# Altium project Breakout_14pin.PrjPcb
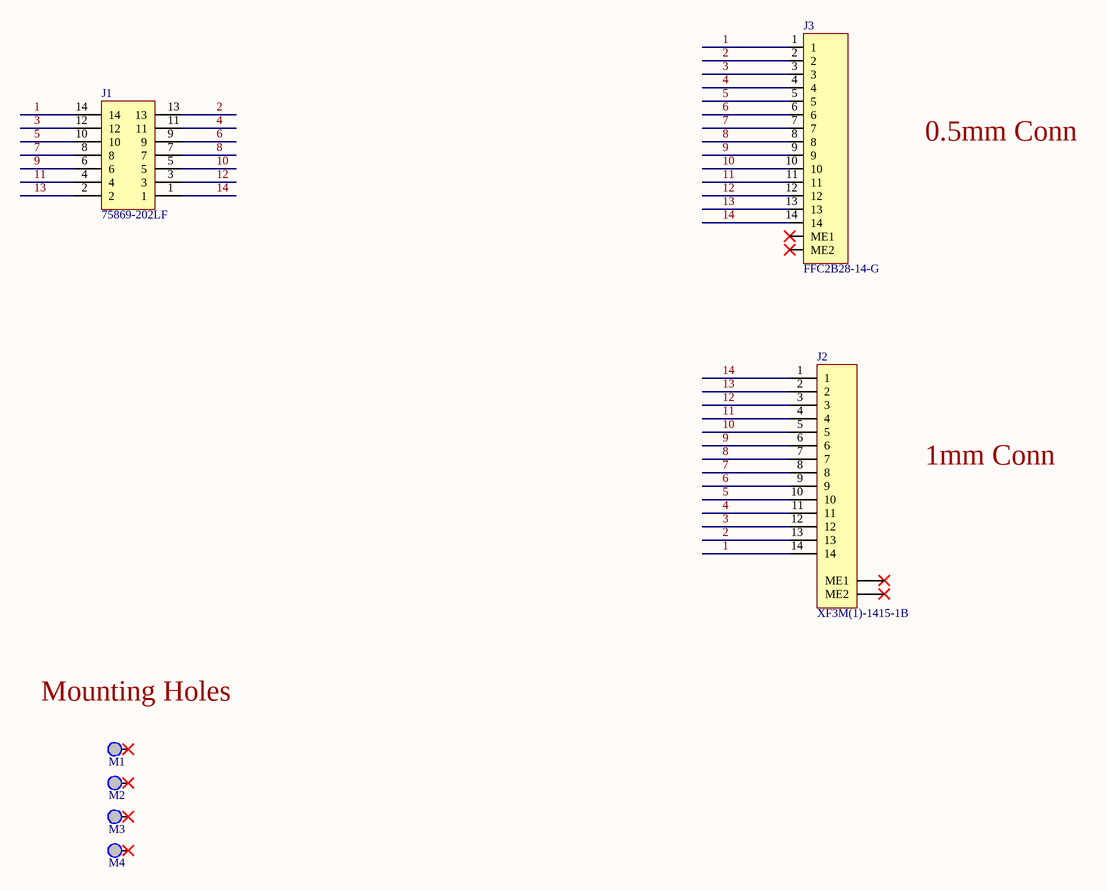
[diagram p0: Main.SchDoc]
ProjectName: Breakout_14pin; Rev: A
1 sheet, 7 parts. Net scope: global (net labels, ports and power ports of the same name join across sheets).
Board file: Breakout_14pin.PcbDoc

## Sheet Main.SchDoc: Breakout 14pin
size A3; Organization: INTERCREATE; Address1: 2415 3RD ST. SUITE #232; Address2: SAN FRANCISCO CA 94107; Revision: A; SheetNumber: 1; SheetTotal: 1; ProjectName: KAGWERKS COMMAND CENTER

### Parts
J1  75869-202LF  [HDR-V-2x7-KEYED]
J2  XF3M(1)-1415-1B  [CONN-FFC-H-14P-1MM]
J3  FFC2B28-14-G  [CONN-FFC-H-14P-0.5MM]
M1  MTG_HOLE  [MH_P_2.5MM]  (value not drawn)  (no BOM)
M2  MTG_HOLE  [MH_P_2.5MM]  (value not drawn)  (no BOM)
M3  MTG_HOLE  [MH_P_2.5MM]  (value not drawn)  (no BOM)
M4  MTG_HOLE  [MH_P_2.5MM]  (value not drawn)  (no BOM)

### Nets
1: J1.14 J2.14 J3.1
2: J1.13 J2.13 J3.2
3: J1.12 J2.12 J3.3
4: J1.11 J2.11 J3.4
5: J1.10 J2.10 J3.5
6: J1.9 J2.9 J3.6
7: J1.8 J2.8 J3.7
8: J1.7 J2.7 J3.8
9: J1.6 J2.6 J3.9
10: J1.5 J2.5 J3.10
11: J1.4 J2.4 J3.11
12: J1.3 J2.3 J3.12
13: J1.2 J2.2 J3.13
14: J1.1 J2.1 J3.14

Not connected (* = marked no-connect by the designer): J2 ME1* ME2*; J3 ME1* ME2*; M1 1*; M2 1*; M3 1*; M4 1*

### Notes on the sheet
- 0.5mm Conn
- 1mm Conn
- (near M1) Mounting Holes
- Title
- Size:
- Date:
- A3
- Number:
- Time:
- Revision:
- Sheet
- of
- File:

### Library data of the parts
J1 = HDR-V-2x7-M: Headers & Wire Housings 14P DR VERT SHRD HDR TIN; Manufacturer 1: Amphenol ICC / FCI; Number of Contacts: 14; Max Voltage Rating (AC): 500V; Gender: Male; Connector Type: Male Pin; Pitch: 2.54mm; Row Spacing: 0.1inch; Contact Post Length: 3.05mm; Supplier 1: Digi-Key; Manufacturer Part Number 1: 75869-202LF; RoHS: Yes; Category: Connectors; Stock 1: 665; Pricing 1: 1=1.00000, 10=0.87700, 100=0.75680, 500=0.61922, 1000=0.55041, 5000=0.48161, 10000=0.45753 (USD); Mount: Through Hole; Contact Plating: Tin; Color: Blue; Contact Material: Bronze; Housing Color: Blue; Housing Material: Thermoplastic; Min Operating Temperature: -65°C; Max Operating Temperature: 125°C; Number of Rows: 2; Termination: Solder; Package Quantity: 23; Packaging: Rail/Tube; Number of Positions: 14; Orientation: Straight; Series: Quickie™, Basics+; Contact Type: Male Pin; Length: 24.99mm; Depth: 9.55mm; Contact Mating Length: 0.236inch; Lead Free: Lead Free; ComponentLink1URL: https://datasheet.ciiva.com/723/75869-723760.pdf?src-supplier=Digi-Key; ComponentLink1Description: https://datasheet.ciiva.com/723/75869-723760.pdf?src-supplier=Digi-Key; Supplier Part Number 1: 609-75869-202LF-ND
J2 = CONN-FFC-H-14P-1MM: 1.0-mm Pitch, Dual Contact ; For FPC/FFC, 14 Contacts, RoHS; Manufacturer 1: Omron; Actuator Material: Polymer,Liquid Crystal Polymer; Actuator Color: Black; Number of Positions: 14; Voltage Rating: 50V; Mating Cycles: 20; Supplier: Digi-Key; Supplier Part Number: Z5875CT-ND; Manufacturer Part Number 1: XF3M(1)-1415-1B; RoHS: No; Category: FFC / FPC; Stock: 3056; Pricing: 1=1.71, 10=1.491, 25=1.4272, 50=1.3954, 100=1.332, 250=1.20516, 500=1.11002 (USD); Mounting Technology: Surface Mount; Pins: 14; Contact Material: Copper Alloy; Contact Plating: Gold; Housing Material: Polymer; Housing Color: Natural; Min Operating Temperature: -30°C; Max Operating Temperature: 85°C; Packaging: Cut Tape; Termination: Solder; Series: XF3M; Flammability Rating: UL94 V-0; ComponentLink1URL: https://omronfs.omron.com/en_US/ecb/products/pdf/en-xf3m.pdf?src-supplier=Digi-Key; ComponentLink1Description: https://omronfs.omron.com/en_US/ecb/products/pdf/en-xf3m.pdf?src-supplier=Digi-Key; ComponentLink2URL: https://datasheet.octopart.com/XF3M%281%29-1415-1B-Omron-datasheet-67143948.pdf?src-supplier=Master+Electronics; ComponentLink2Description: https://datasheet.octopart.com/XF3M%281%29-1415-1B-Omron-datasheet-67143948.pdf?src-supplier=Master+Electronics
J3 = CONN-FFC-H-14P-0.5MM: 14W, 0.5MM Ffc Con, R/a, Dual Cont,; Manufacturer 1: Global Connector Technology; Supplier 1: Newark; Manufacturer Part Number 1: FFC2B28-14-G; RoHS: No; Category: Connectors; Stock 1: 3095; Pricing 1: 1=0.28900, 10=0.28900, 25=0.28900, 50=0.26500, 100=0.26500, 250=0.26500, 500=0.24500 (USD); Supplier Part Number 1: 71AJ9616
M1-M4 = MTG_HOLE: MTG HOLE PLATED VARIOUS SIZES

## Assembly variants
Mfg: not fitted J1 J1 J1 J1 J1 J1 J1